# Altium schematic sheet DC_DC.SchDoc
size 220 x 165 mm
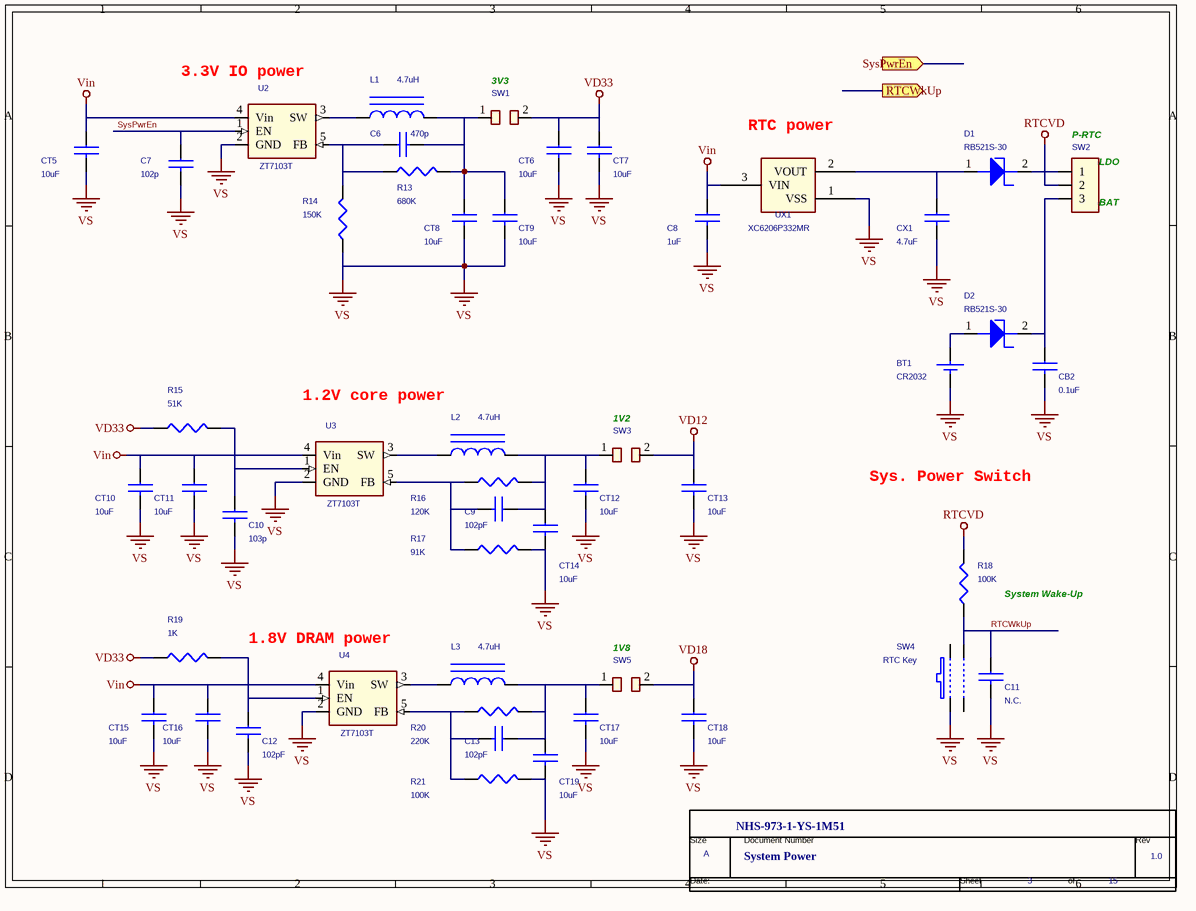
[diagram p0: DC_DC.SchDoc]

## Parts
*  RevCode: 1.0  Page Size: A  Page Number: 3  Page Count: 15  Doc: System Power  OrgName: NHS-973-1-YS-1M51  (hidden comment: TitleBlock0N)  (graphical)
BT1  CR2032  [BAT\CR2032-4-2]
C6  470p  [C0603]
C7  102p  [C0603]
C8  1uF  [C0603]
C9  102pF  [C0603]
C10  103p  [C0603]
C11  N.C.  [C0603]
C12  102pF  [C0603]
C13  102pF  [C0603]
CB2  0.1uF  [C0603]
CT5  10uF  [C0603]
CT6  10uF  [C0603]
CT7  10uF  [C0603]
CT8  10uF  [C0603]
CT9  10uF  [C0603]
CT10  10uF  [C0603]
CT11  10uF  [C0603]
CT12  10uF  [C0603]
CT13  10uF  [C0603]
CT14  10uF  [C0603]
CT15  10uF  [C0603]
CT16  10uF  [C0603]
CT17  10uF  [C0603]
CT18  10uF  [C0603]
CT19  10uF  [C0603]
CX1  4.7uF  [C0603]
D1  RB521S-30  [SOD-523]
D2  RB521S-30  [SOD-523]
L1  4.7uH  [SMTDR43]
L2  4.7uH  [SMTDR43]
L3  4.7uH  [SMTDR43]
R13  680K  [R0603]
R14  150K  [R0603]
R15  51K  [R0603]
R16  120K  [R0603]
R17  91K  [R0603]
R18  100K  [R0603]
R19  1K  [R0603]
R20  220K  [R0603]
R21  100K  [R0603]
SW1  VD33  [2P-1.2mm]  (value not drawn)
SW2  VRTC  [Header_3x1_2.54mm]  (value not drawn)
SW3  VD12  [2P-1.2mm]  (value not drawn)
SW4  RTC Key  [STS-B5]
SW5  VD18  [2P-1.2mm]  (value not drawn)
U2  ZT7103T  [SOT-25]
U3  ZT7103T  [SOT-25]
U4  ZT7103T  [SOT-25]
UX1  XC6206P332MR  [SOT-23]

## Ports
RTCWkUp (out), SysPwrEn (in)

## Nets
RTCVD: R18.2 SW2.2
VD12: CT13.1 SW3.2(\)
VD18: CT18.1 SW5.2(\)
VD33: CT6.1 CT7.1 R15.1 R19.1 SW1.2(\)
Vin: C8.1 CT5.1 CT10.1 CT11.1 CT15.1 CT16.1 U2.4(Vin) U3.4(Vin) U4.4(Vin) UX1.3(VIN)
VS: BT1.1 C7.2 C8.2 C10.2 C11.2 C12.2 CB2.2 CT5.2 CT6.2 CT7.2 CT8.2 CT9.2 CT10.2 CT11.2 CT12.2 CT13.2 CT14.2 CT15.2 CT16.2 CT17.2 CT18.2 CT19.2 CX1.2 R14.1 R17.1 R21.1 SW4.4 U2.2(GND) U3.2(GND) U4.2(GND) UX1.1(VSS)
RTCWkUp: C11.1 R18.1 SW4.1
SysPwrEn: C7.1 U2.1(EN)
NetBT1_2: BT1.2 D2.1
NetC6_1: C6.1 R13.1 R14.2 U2.5(FB)
NetC6_2: C6.2 CT8.1 CT9.1 L1.2 R13.2 SW1.1(\)
NetC9_1: C9.1 CT12.1 CT14.1 L2.2 R16.2 SW3.1(\)
NetC9_2: C9.2 R16.1 R17.2 U3.5(FB)
NetC10_1: C10.1 R15.2 U3.1(EN)
NetC12_1: C12.1 R19.2 U4.1(EN)
NetC13_1: C13.1 CT17.1 CT19.1 L3.2 R20.2 SW5.1(\)
NetC13_2: C13.2 R20.1 R21.2 U4.5(FB)
NetCB2_1: CB2.1 D2.2 SW2.3
NetCX1_1: CX1.1 D1.1 UX1.2(VOUT)
NetD1_2: D1.2 SW2.1
NetL1_1: L1.1 U2.3(SW)
NetL2_1: L2.1 U3.3(SW)
NetL3_1: L3.1 U4.3(SW)

Not connected (* = marked no-connect by the designer): SW4 2 3

## Notes on the sheet
- (near U2) 3.3V IO power
- (near SW1) 3V3
- (near UX1) RTC power
- (near SW2) P-RTC
- (near SW2) LDO
- (near SW2) BAT
- 1.2V core power
- (near SW3) 1V2
- Sys. Power Switch
- 1.8V DRAM power
- (near R18) System Wake-Up
- (near SW5) 1V8
- (in symbol TitleBlock0N) Size; Document Number; Rev; Date:; Sheet; of

## Library data of the parts
BT1 = BATTERY ELEM
C6-C13 CB2 CT5-CT19 CX1 = CAP NP
D1 D2 = ZENAR_0: Package: D
L1-L3 = INDUCTOR IRON
R13-R21 = R
SW1 SW3 SW5 = SW2PHS
SW2 = CON3
SW4 = SW-S
U2-U4 = ZT7103S_0
UX1 = XC6206P182MR
* = TitleBlock0N: Page Create Date: April 25, 1995